# EAGLE design 32-pin QFN+TQFP (EAGLE 6.3)
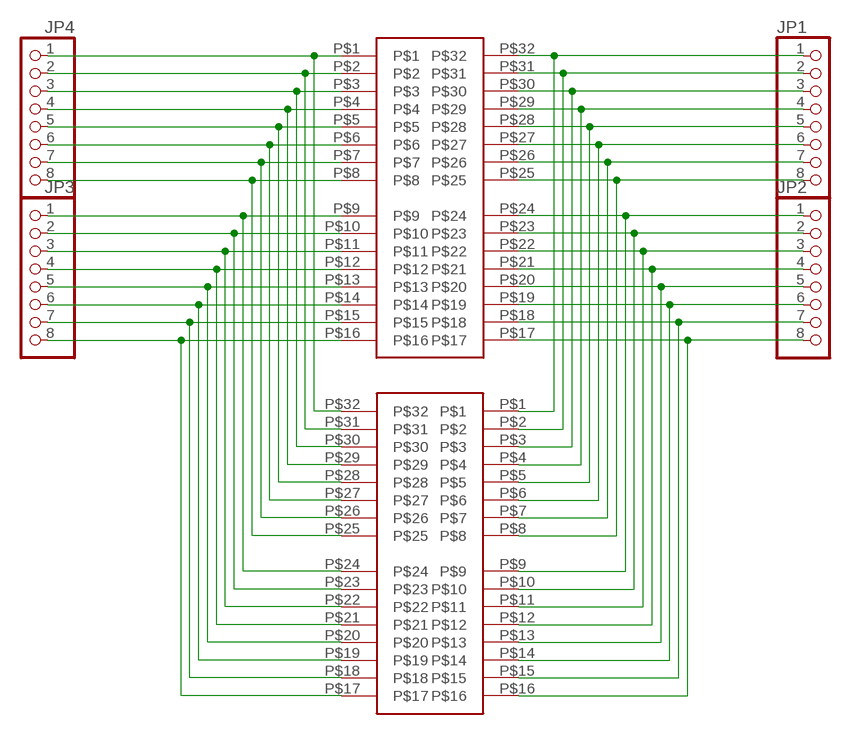
[diagram p0: schematic, sheet 1]

## Parts
JP1  PADS-8CLEANBIG  [PADS-8]
JP2  PADS-8CLEANBIG  [PADS-8]
JP3  PADS-8CLEANBIG  [PADS-8]
JP4  PADS-8CLEANBIG  [PADS-8]
U$1  32-PINQFN  [QFN32]
U$2  32-PINTQFP  [TQFP32-08]

## Nets
N$1: JP4.1 U$1.P$1 U$2.P$32
N$2: JP4.2 U$1.P$2 U$2.P$31
N$3: JP4.3 U$1.P$3 U$2.P$30
N$4: JP4.4 U$1.P$4 U$2.P$29
N$5: JP4.5 U$1.P$5 U$2.P$28
N$6: JP4.6 U$1.P$6 U$2.P$27
N$7: JP4.7 U$1.P$7 U$2.P$26
N$8: JP4.8 U$1.P$8 U$2.P$25
N$9: JP3.1 U$1.P$9 U$2.P$24
N$10: JP3.2 U$1.P$10 U$2.P$23
N$11: JP3.3 U$1.P$11 U$2.P$22
N$12: JP3.4 U$1.P$12 U$2.P$21
N$13: JP3.5 U$1.P$13 U$2.P$20
N$14: JP3.6 U$1.P$14 U$2.P$19
N$15: JP3.7 U$1.P$15 U$2.P$18
N$16: JP3.8 U$1.P$16 U$2.P$17
N$17: JP1.1 U$1.P$32 U$2.P$1
N$18: JP1.2 U$1.P$31 U$2.P$2
N$19: JP1.3 U$1.P$30 U$2.P$3
N$20: JP1.4 U$1.P$29 U$2.P$4
N$21: JP1.5 U$1.P$28 U$2.P$5
N$22: JP1.6 U$1.P$27 U$2.P$6
N$23: JP1.7 U$1.P$26 U$2.P$7
N$24: JP1.8 U$1.P$25 U$2.P$8
N$25: JP2.1 U$1.P$24 U$2.P$9
N$26: JP2.2 U$1.P$23 U$2.P$10
N$27: JP2.3 U$1.P$22 U$2.P$11
N$28: JP2.4 U$1.P$21 U$2.P$12
N$29: JP2.5 U$1.P$20 U$2.P$13
N$30: JP2.6 U$1.P$19 U$2.P$14
N$31: JP2.7 U$1.P$18 U$2.P$15
N$32: JP2.8 U$1.P$17 U$2.P$16

## Library data of the parts
JP1-JP4 = breakouts:PADS-8: PIN HEADER
U$1 U$2 = breakouts:32-PIN

## Board
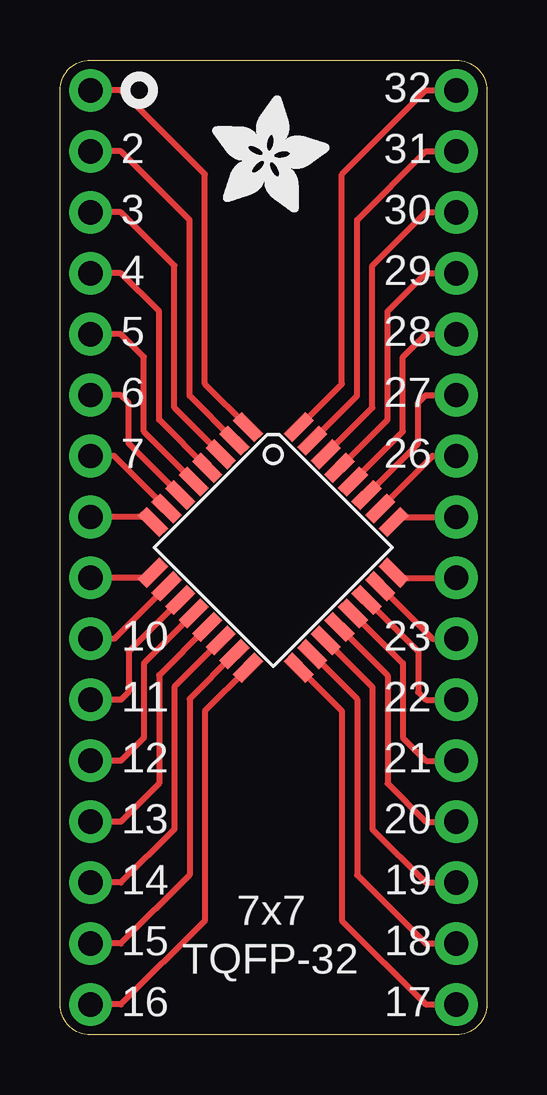
[diagram p1: board, top side]
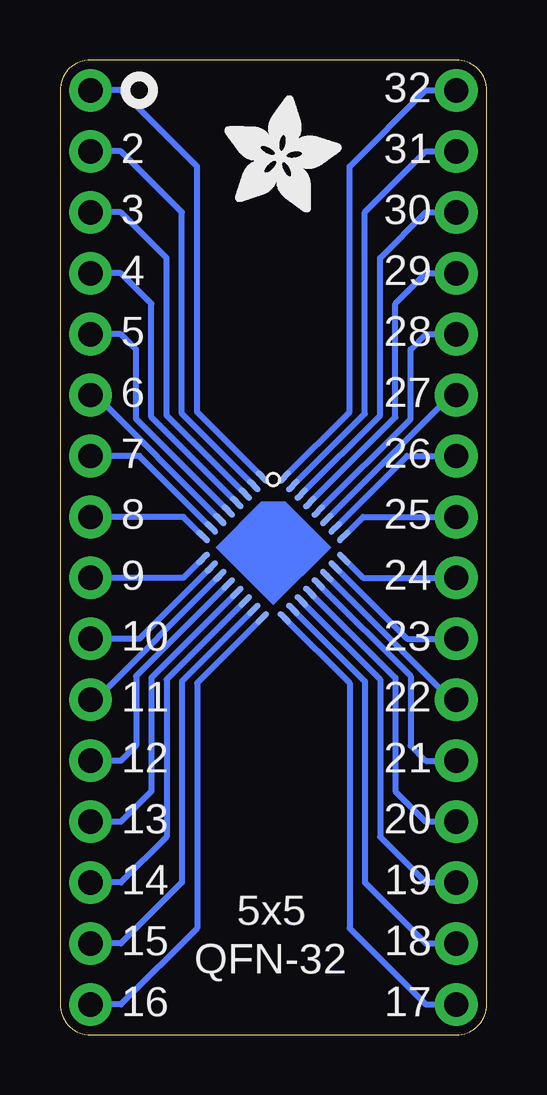
[diagram p2: board, bottom side, seen from below]

Size 17.78 x 40.64 mm. Coordinates in mm from the lower left corner, seen from the top.
Outline: 0,1.27 0,39.37 arc-90 1.27,40.64 16.51,40.64 arc-90 17.78,39.37 17.78,1.27 arc-90 16.51,0 1.27,0 arc-90 0,1.27
Copper layers (1*16): Top 0.035mm / dielectric 1.5mm / Bottom 0.035mm
Design rules: minimum track width 8mil, minimum drill 16mil, track to track 8mil, track to pad 8mil, pad to pad 8mil, via to via 8mil, smd to smd 8mil, copper to edge 10mil, drill to drill 8mil, minimum pad ring 10mil, minimum via ring 8mil, stop-mask expansion 4mil, vias tented up to drill 20mil, thermal gap 10mil

### Footprints (pad centres in the part's own frame; a part is rotated, then mirrored left to right if it is on the bottom)
PADS-8 = drill 1.016 pad 1.778: 1 -8.89,0; 2 -6.35,0; 3 -3.81,0; 4 -1.27,0; 5 1.27,0; 6 3.81,0; 7 6.35,0; 8 8.89,0
QFN32 = smd 0.25 x 0.7: P$1 -1.75,2.4; P$2 -1.25,2.4; P$3 -0.75,2.4; P$4 -0.25,2.4; P$5 0.25,2.4; P$6 0.75,2.4; P$7 1.25,2.4; P$8 1.75,2.4; P$17 1.75,-2.4; P$18 1.25,-2.4; P$19 0.75,-2.4; P$20 0.25,-2.4; P$21 -0.25,-2.4; P$22 -0.75,-2.4; P$23 -1.25,-2.4; P$24 -1.75,-2.4 | smd 0.7 x 0.25: P$9 2.4,1.75; P$10 2.4,1.25; P$11 2.4,0.75; P$12 2.4,0.25; P$13 2.4,-0.25; P$14 2.4,-0.75; P$15 2.4,-1.25; P$16 2.4,-1.75; P$25 -2.4,-1.75; P$26 -2.4,-1.25; P$27 -2.4,-0.75; P$28 -2.4,-0.25; P$29 -2.4,0.25; P$30 -2.4,0.75; P$31 -2.4,1.25; P$32 -2.4,1.75
TQFP32-08 = smd 0.508 x 1.27: P$1 -2.8,4.293; P$2 -2,4.293; P$3 -1.2,4.293; P$4 -0.4,4.293; P$5 0.4,4.293; P$6 1.2,4.293; P$7 2,4.293; P$8 2.8,4.293; P$17 2.8,-4.293; P$18 2,-4.293; P$19 1.2,-4.293; P$20 0.4,-4.293; P$21 -0.4,-4.293; P$22 -1.2,-4.293; P$23 -2,-4.293; P$24 -2.8,-4.293 | smd 1.27 x 0.508: P$9 4.293,2.8; P$10 4.293,2; P$11 4.293,1.2; P$12 4.293,0.4; P$13 4.293,-0.4; P$14 4.293,-1.2; P$15 4.293,-2; P$16 4.293,-2.8; P$25 -4.293,-2.8; P$26 -4.293,-2; P$27 -4.293,-1.2; P$28 -4.293,-0.4; P$29 -4.293,0.4; P$30 -4.293,1.2; P$31 -4.293,2; P$32 -4.293,2.8

### Placement (x,y rotation side)
JP1  16.51,30.48 270 top
JP2  16.51,10.16 270 top
JP3  1.27,10.16 270 top
JP4  1.27,30.48 270 top
U$1  8.89,20.32 315 bottom
U$2  8.89,20.32 315 top
U$3  [ADAFRUIT_5MM]  6.35,34.29 0 top
U$4  [ADAFRUIT_5MM]  10.92,34.29 0 bottom

### Tracks (layer width: path | path; a pad name or v marks a point on that pad's centre or on a via)
N$1
  Top 0.254: U$2.P$32 6.03,27.14 6.03,35.88 2.54,39.37 JP4.1
  Bottom 0.254: U$1.P$1 5.71,25.97 5.71,36.2 2.54,39.37 JP4.1
N$2
  Top 0.254: U$2.P$31 5.4,26.64 5.4,33.97 2.54,36.83 JP4.2
  Bottom 0.254: U$1.P$2 5.08,25.9 5.08,34.29 2.54,36.83 JP4.2
N$3
  Top 0.254: U$2.P$30 4.76,26.14 4.76,32.07 2.54,34.29 JP4.3
  Bottom 0.254: U$1.P$3 4.45,25.83 4.45,32.38 2.54,34.29 JP4.3
N$4
  Top 0.254: U$2.P$29 4.13,25.65 4.13,30.16 2.54,31.75 JP4.4
  Bottom 0.254: U$1.P$4 3.81,25.75 3.81,30.48 2.54,31.75 JP4.4
N$5
  Top 0.254: U$2.P$28 3.49,25.15 3.49,28.26 2.54,29.21 JP4.5
  Bottom 0.254: U$1.P$5 3.17,25.68 3.17,28.57 2.54,29.21 JP4.5
N$6
  Top 0.254: U$2.P$27 2.86,24.66 2.86,26.35 2.54,26.67 JP4.6
  Bottom 0.254: U$1.P$6 1.48,26.67 JP4.6
N$7
  Top 0.254: U$2.P$26 2.25,24.13 JP4.7
  Bottom 0.254: U$1.P$7 3.31,24.13 JP4.7
N$8
  Top 0.254: U$2.P$25 3.66,21.59 JP4.8
  Bottom 0.254: U$1.P$8 5.14,21.59 JP4.8
N$9
  Top 0.254: U$2.P$24 3.66,19.05 JP3.1
  Bottom 0.254: U$1.P$9 5.14,19.05 JP3.1
N$10
  Top 0.254: U$2.P$23 2.25,16.51 JP3.2
  Bottom 0.254: U$1.P$10 3.31,16.51 JP3.2
N$11
  Top 0.254: U$2.P$22 2.86,15.98 2.86,14.29 2.54,13.97 JP3.3
  Bottom 0.254: U$1.P$11 1.48,13.97 JP3.3
N$12
  Top 0.254: U$2.P$21 3.49,15.49 3.49,12.38 2.54,11.43 JP3.4
  Bottom 0.254: U$1.P$12 3.17,14.96 3.17,12.06 2.54,11.43 JP3.4
N$13
  Top 0.254: U$2.P$20 4.13,14.99 4.13,10.48 2.54,8.89 JP3.5
  Bottom 0.254: U$1.P$13 3.81,14.89 3.81,10.16 2.54,8.89 JP3.5
N$14
  Top 0.254: U$2.P$19 4.76,14.49 4.76,8.57 2.54,6.35 JP3.6
  Bottom 0.254: U$1.P$14 4.45,14.81 4.45,8.26 2.54,6.35 JP3.6
N$15
  Top 0.254: U$2.P$18 5.4,14 5.4,6.67 2.54,3.81 JP3.7
  Bottom 0.254: U$1.P$15 5.08,14.74 5.08,6.35 2.54,3.81 JP3.7
N$16
  Top 0.254: U$2.P$17 6.03,13.5 6.03,4.76 2.54,1.27 JP3.8
  Bottom 0.254: U$1.P$16 5.71,14.67 5.71,4.45 2.54,1.27 JP3.8
N$17
  Top 0.254: U$2.P$1 11.75,27.14 11.75,35.88 15.24,39.37 JP1.1
  Bottom 0.254: U$1.P$32 12.06,25.97 12.06,36.2 15.24,39.37 JP1.1
N$18
  Top 0.254: U$2.P$2 12.38,26.64 12.38,33.97 15.24,36.83 JP1.2
  Bottom 0.254: U$1.P$31 12.7,25.9 12.7,34.29 15.24,36.83 JP1.2
N$19
  Top 0.254: U$2.P$3 13.02,26.14 13.02,32.07 15.24,34.29 JP1.3
  Bottom 0.254: U$1.P$30 13.34,25.83 13.34,32.38 15.24,34.29 JP1.3
N$20
  Top 0.254: U$2.P$4 13.65,25.65 13.65,30.16 15.24,31.75 JP1.4
  Bottom 0.254: U$1.P$29 13.97,25.75 13.97,30.48 15.24,31.75 JP1.4
N$21
  Top 0.254: U$2.P$5 14.29,25.15 14.29,28.26 15.24,29.21 JP1.5
  Bottom 0.254: U$1.P$28 14.61,25.68 14.61,28.57 15.24,29.21 JP1.5
N$22
  Top 0.254: U$2.P$6 14.92,24.66 14.92,26.35 15.24,26.67 JP1.6
  Bottom 0.254: U$1.P$27 16.3,26.67 JP1.6
N$23
  Top 0.254: U$2.P$7 15.53,24.13 JP1.7
  Bottom 0.254: U$1.P$26 14.47,24.13 JP1.7
N$24
  Top 0.254: U$2.P$8 14.12,21.59 JP1.8
  Bottom 0.254: U$1.P$25 12.63,21.59 JP1.8
N$25
  Top 0.254: U$2.P$9 14.12,19.05 JP2.1
  Bottom 0.254: U$1.P$24 12.63,19.05 JP2.1
N$26
  Top 0.254: U$2.P$10 15.53,16.51 JP2.2
  Bottom 0.254: U$1.P$23 14.47,16.51 JP2.2
N$27
  Top 0.254: U$2.P$11 14.92,15.98 14.92,14.29 15.24,13.97 JP2.3
  Bottom 0.254: U$1.P$22 16.3,13.97 JP2.3
N$28
  Top 0.254: U$2.P$12 14.29,15.49 14.29,12.38 15.24,11.43 JP2.4
  Bottom 0.254: U$1.P$21 14.61,14.96 14.61,12.06 15.24,11.43 JP2.4
N$29
  Top 0.254: U$2.P$13 13.65,14.99 13.65,10.48 15.24,8.89 JP2.5
  Bottom 0.254: U$1.P$20 13.97,14.89 13.97,10.16 15.24,8.89 JP2.5
N$30
  Top 0.254: U$2.P$14 13.02,14.49 13.02,8.57 15.24,6.35 JP2.6
  Bottom 0.254: U$1.P$19 13.34,14.81 13.34,8.26 15.24,6.35 JP2.6
N$31
  Top 0.254: U$2.P$15 12.38,14 12.38,6.67 15.24,3.81 JP2.7
  Bottom 0.254: U$1.P$18 12.7,14.74 12.7,6.35 15.24,3.81 JP2.7
N$32
  Top 0.254: U$2.P$16 11.75,13.5 11.75,4.76 15.24,1.27 JP2.8
  Bottom 0.254: U$1.P$17 12.06,14.67 12.06,4.45 15.24,1.27 JP2.8

### Text on the board
tPlace: 32 | 31 | 2 | 30 | 3 | 29 | 4 | 28 | 5 | 27 | 6 | 26 | 7 | 23 | 10 | 22 | 11 | 21 | 12 | 20 | 13 | 19 | 14 | 7x7 | 18 | 15 | TQFP-32 | 17 | 16
bPlace: 32 | 31 | 2 | 30 | 3 | 29 | 4 | 28 | 5 | 27 | 6 | 26 | 7 | 25 | 8 | 24 | 9 | 23 | 10 | 22 | 11 | 21 | 12 | 20 | 13 | 19 | 14 | 18 | 5x5 | QFN-32 | 15 | 17 | 16